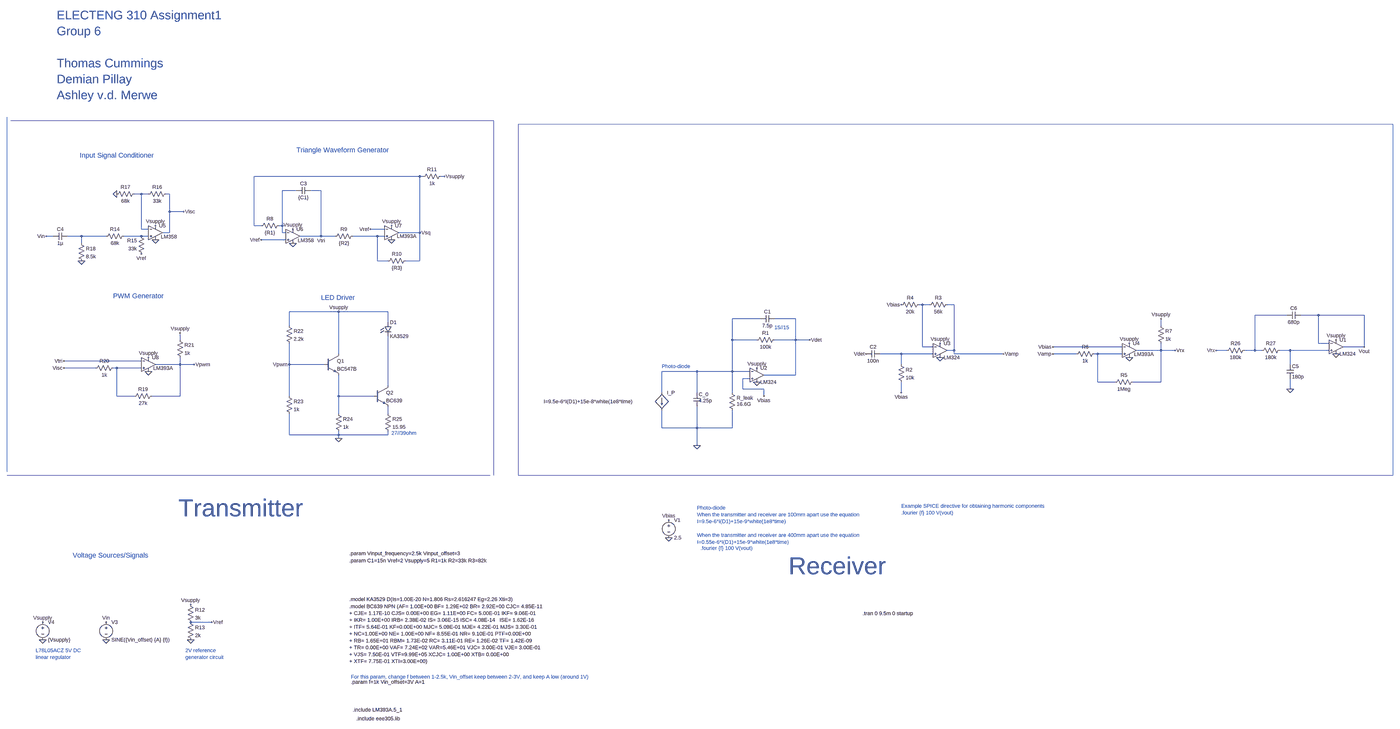
[diagram p0: schematic Assignment2_LM324_demian.asc, whole sheet]
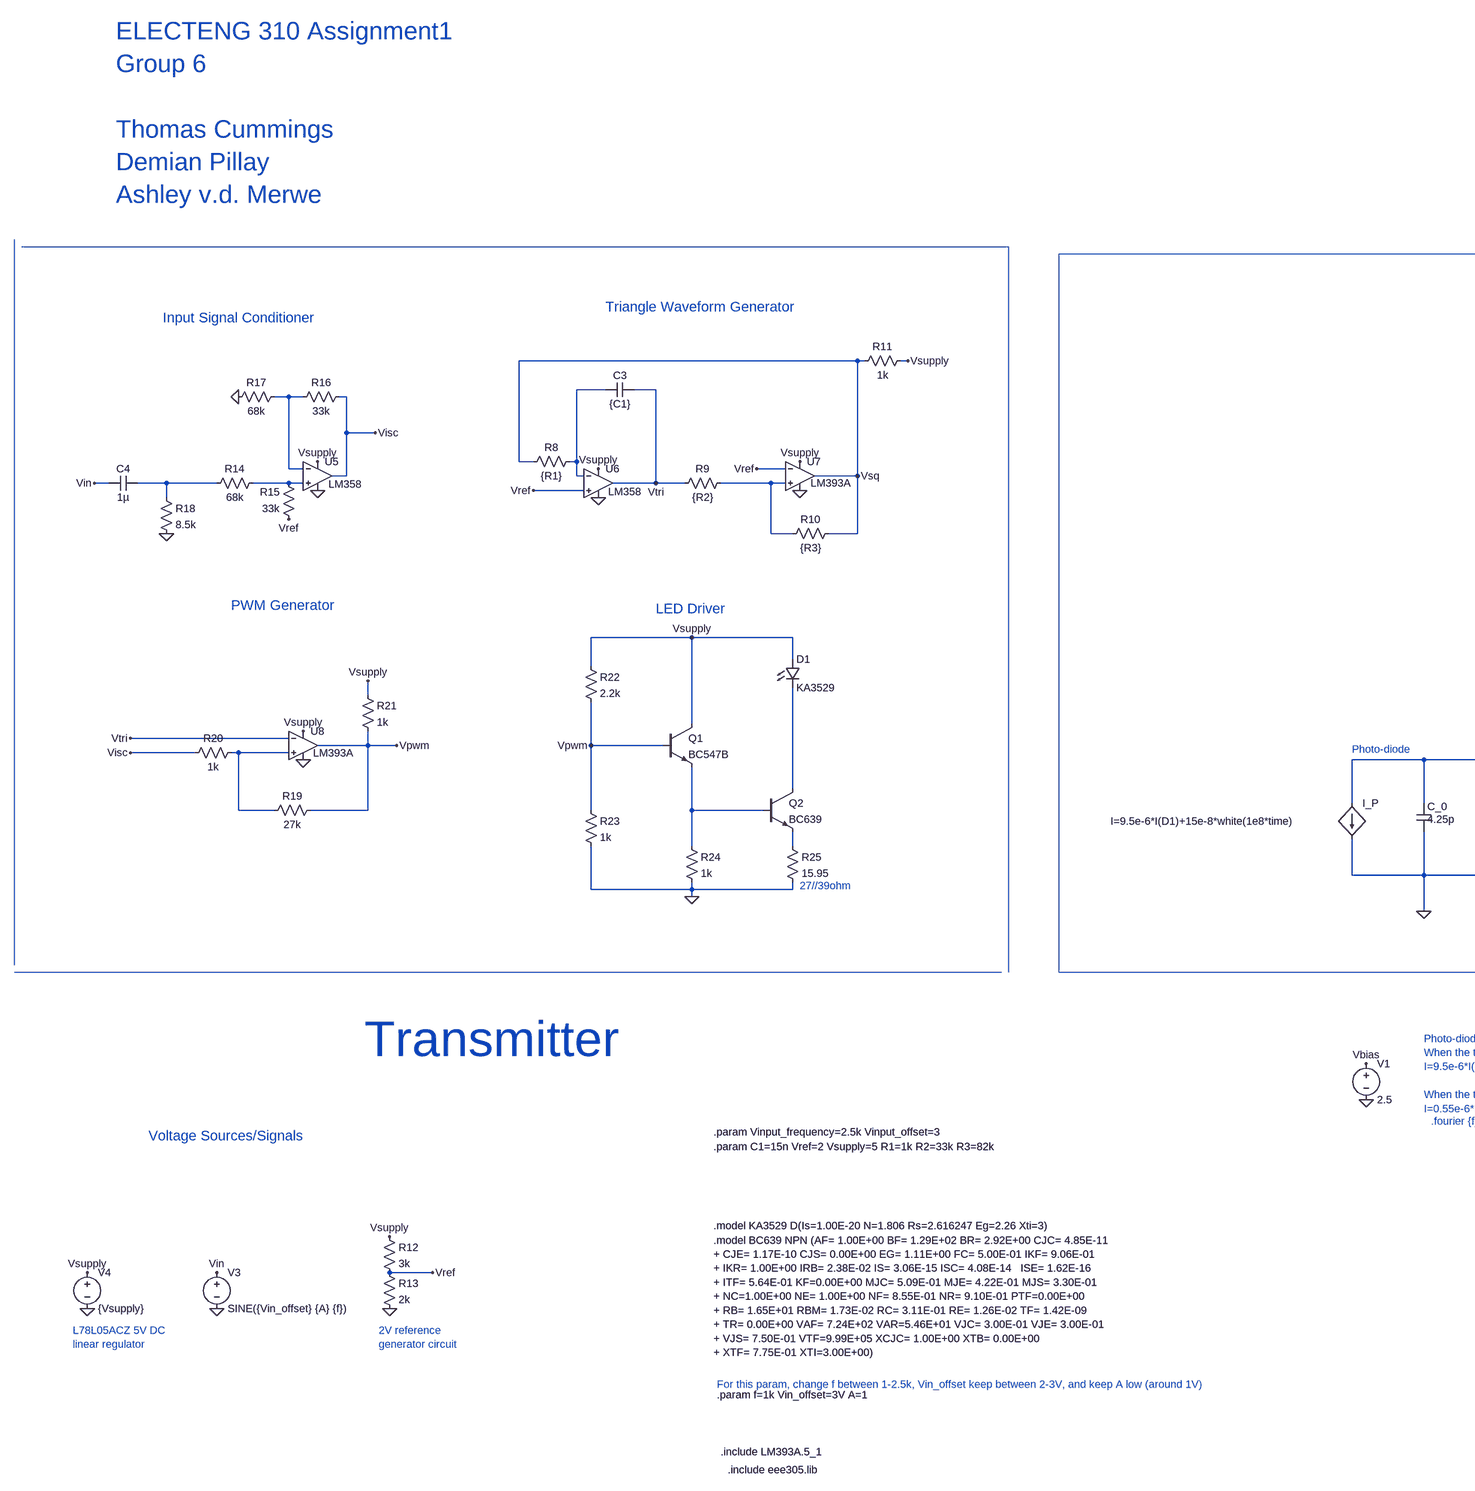
[diagram p1: schematic Assignment2_LM324_demian.asc, part, row 1 of 1, column 1 of 2]
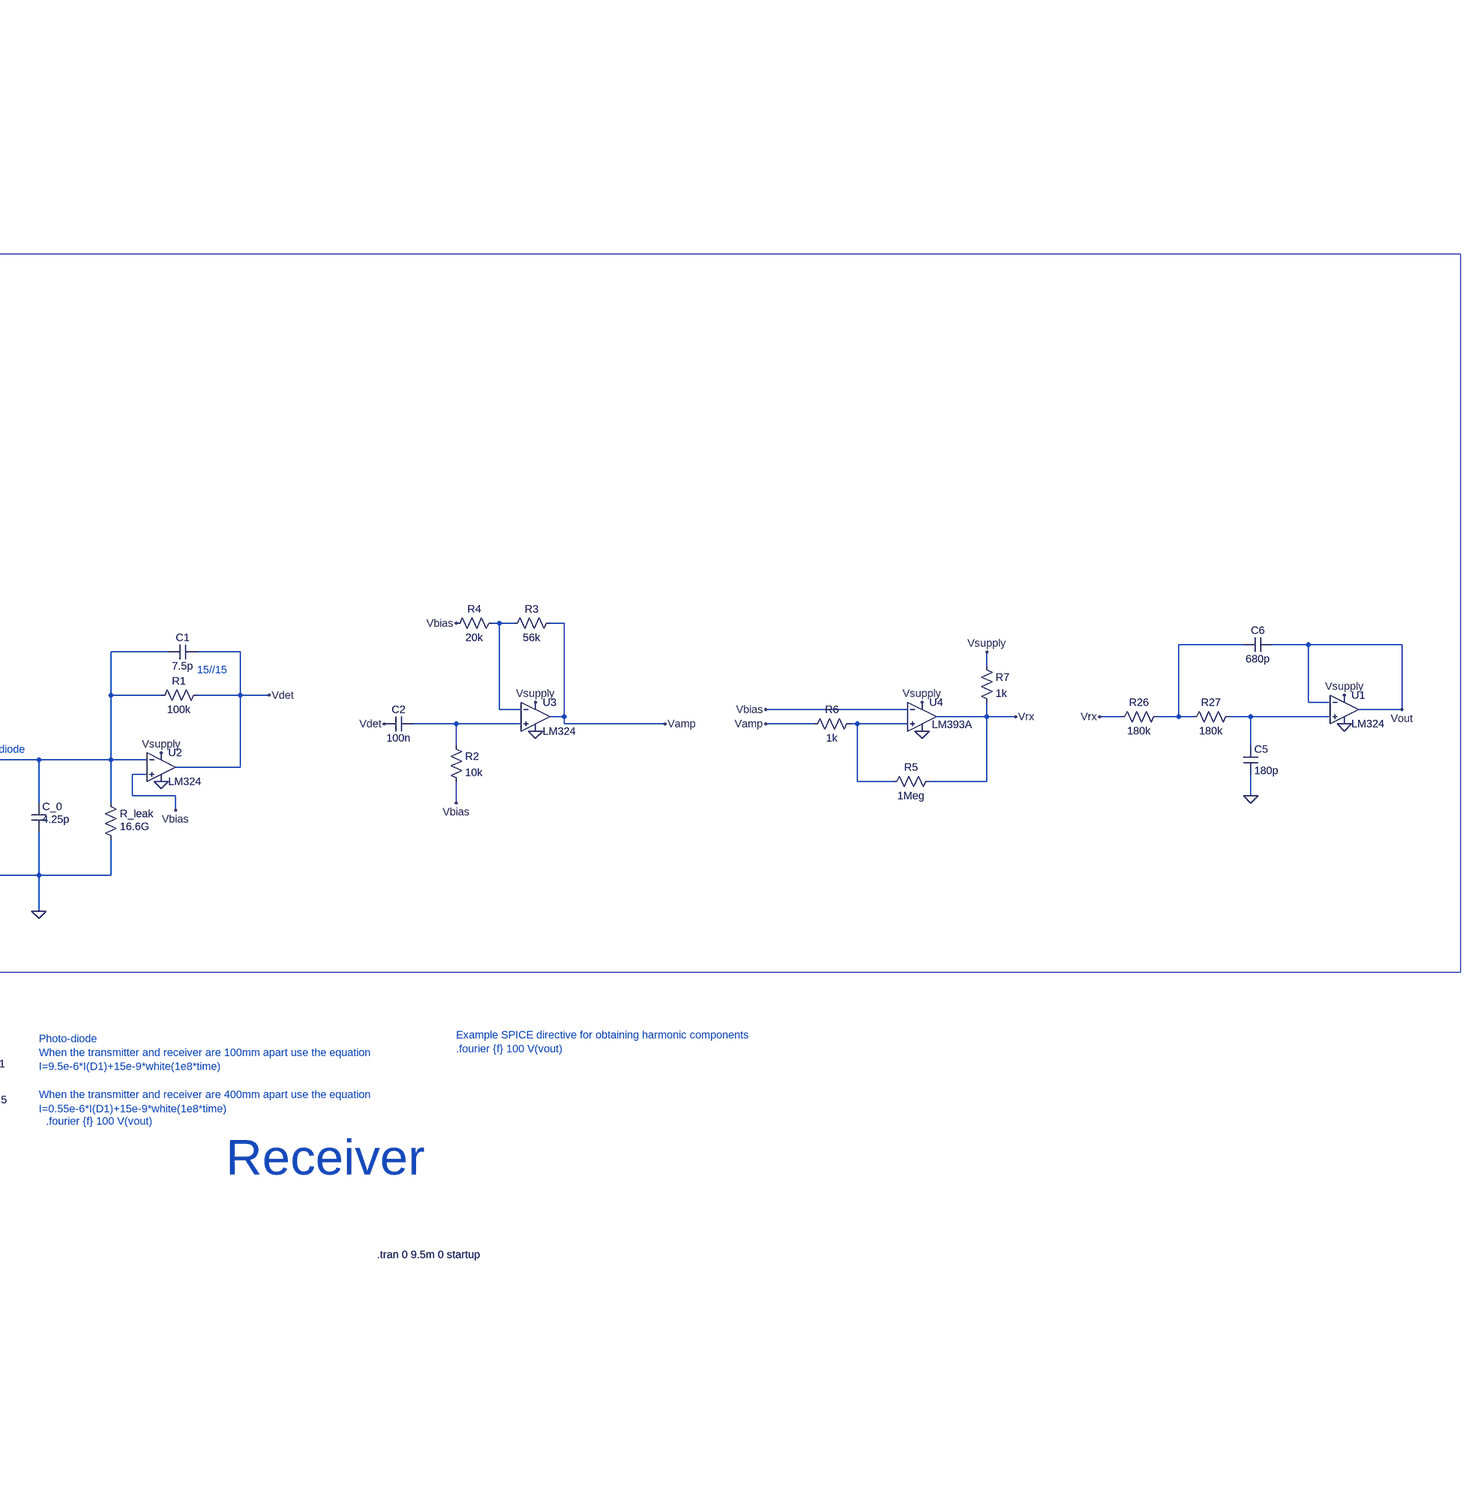
[diagram p2: schematic Assignment2_LM324_demian.asc, part, row 1 of 1, column 2 of 2]
Assignment2_LM324_demian.asc, the LTspice schematic file:
Version 4
SHEET 1 6180 2120
WIRE 1456 -928 704 -928
WIRE 1472 -928 1456 -928
WIRE 1568 -928 1552 -928
WIRE 896 -864 832 -864
WIRE 1008 -864 960 -864
WIRE 192 -848 160 -848
WIRE 224 -848 192 -848
WIRE 320 -848 304 -848
WIRE 320 -768 320 -848
WIRE 384 -768 320 -768
WIRE 704 -704 704 -928
WIRE 736 -704 704 -704
WIRE 832 -704 832 -864
WIRE 832 -704 816 -704
WIRE 192 -688 192 -848
WIRE 224 -688 192 -688
WIRE 1296 -688 1232 -688
WIRE 320 -672 320 -768
WIRE 320 -672 288 -672
WIRE 832 -672 832 -704
WIRE 848 -672 832 -672
WIRE 1456 -672 1456 -928
WIRE 1456 -672 1360 -672
WIRE -208 -656 -240 -656
WIRE -80 -656 -144 -656
WIRE 32 -656 -80 -656
WIRE 192 -656 112 -656
WIRE 224 -656 192 -656
WIRE 1008 -656 1008 -864
WIRE 1008 -656 912 -656
WIRE 1072 -656 1008 -656
WIRE 1264 -656 1152 -656
WIRE 1296 -656 1264 -656
WIRE 848 -640 736 -640
WIRE -80 -624 -80 -656
WIRE 1264 -544 1264 -656
WIRE 1312 -544 1264 -544
WIRE 1456 -544 1456 -672
WIRE 1456 -544 1392 -544
WIRE 3744 -320 3728 -320
WIRE 3776 -320 3744 -320
WIRE 3888 -320 3856 -320
WIRE 1088 -288 864 -288
WIRE 1312 -288 1088 -288
WIRE 5488 -272 5344 -272
WIRE 5632 -272 5552 -272
WIRE 5840 -272 5632 -272
WIRE 3008 -256 2880 -256
WIRE 3168 -256 3072 -256
WIRE 1312 -240 1312 -288
WIRE 864 -224 864 -288
WIRE 4864 -224 4864 -256
WIRE 368 -160 368 -192
WIRE 2880 -160 2880 -256
WIRE 2992 -160 2880 -160
WIRE 3168 -160 3168 -256
WIRE 3168 -160 3072 -160
WIRE 3232 -160 3168 -160
WIRE 5632 -144 5632 -272
WIRE 5680 -144 5632 -144
WIRE 3744 -128 3744 -320
WIRE 3792 -128 3744 -128
WIRE 4688 -128 4336 -128
WIRE 5840 -128 5840 -272
WIRE 5840 -128 5744 -128
WIRE 3888 -112 3888 -320
WIRE 3888 -112 3856 -112
WIRE 4864 -112 4864 -144
WIRE 4864 -112 4752 -112
WIRE 4928 -112 4864 -112
WIRE 5216 -112 5168 -112
WIRE 5344 -112 5344 -272
WIRE 5344 -112 5296 -112
WIRE 5376 -112 5344 -112
WIRE 5504 -112 5456 -112
WIRE 5680 -112 5504 -112
WIRE 1088 -96 1088 -288
WIRE 3648 -96 3552 -96
WIRE 3792 -96 3648 -96
WIRE 3888 -96 3888 -112
WIRE 4112 -96 3888 -96
WIRE 4480 -96 4336 -96
WIRE 4576 -96 4560 -96
WIRE 4688 -96 4576 -96
WIRE 192 -64 -160 -64
WIRE 368 -48 368 -80
WIRE 368 -48 256 -48
WIRE 432 -48 368 -48
WIRE 864 -48 864 -144
WIRE 1024 -48 864 -48
WIRE 3648 -48 3648 -96
WIRE 5504 -48 5504 -112
WIRE -16 -32 -160 -32
WIRE 80 -32 64 -32
WIRE 192 -32 80 -32
WIRE 2720 -16 2560 -16
WIRE 2880 -16 2880 -160
WIRE 2880 -16 2720 -16
WIRE 2960 -16 2880 -16
WIRE 3168 0 3168 -160
WIRE 3168 0 3024 0
WIRE 2960 16 2928 16
WIRE 4576 32 4576 -96
WIRE 4656 32 4576 32
WIRE 4864 32 4864 -112
WIRE 4864 32 4736 32
WIRE 1312 48 1312 -176
WIRE 2928 64 2928 16
WIRE 3024 64 2928 64
WIRE 5504 64 5504 16
WIRE 2560 80 2560 -16
WIRE 2720 80 2720 -16
WIRE 2880 80 2880 -16
WIRE 3648 80 3648 32
WIRE 80 96 80 -32
WIRE 160 96 80 96
WIRE 368 96 368 -48
WIRE 368 96 240 96
WIRE 864 96 864 -48
WIRE 1088 96 1088 0
WIRE 1248 96 1088 96
WIRE 3024 96 3024 64
WIRE 1088 176 1088 96
WIRE 1312 176 1312 144
WIRE 2560 240 2560 160
WIRE 2720 240 2720 144
WIRE 2720 240 2560 240
WIRE 2880 240 2880 160
WIRE 2880 240 2720 240
WIRE 864 272 864 176
WIRE 1088 272 1088 256
WIRE 1088 272 864 272
WIRE 1312 272 1312 256
WIRE 1312 272 1088 272
WIRE 1088 288 1088 272
WIRE 2720 320 2720 240
WIRE 512 1312 416 1312
FLAG 32 1392 0
FLAG 32 1312 Vin
FLAG 2720 320 0
FLAG 2592 896 0
FLAG 2992 32 0
FLAG 2992 -32 Vsupply
FLAG 3824 -80 0
FLAG 3824 -144 Vsupply
FLAG 2592 816 Vbias
FLAG 3024 96 Vbias
FLAG 3648 80 Vbias
FLAG 3648 -320 Vbias
FLAG 3232 -160 Vdet
FLAG 3488 -96 Vdet
FLAG 4720 -144 Vsupply
FLAG 4720 -80 0
FLAG 4336 -128 Vbias
FLAG 4864 -256 Vsupply
FLAG 4928 -112 Vrx
FLAG -256 1392 0
FLAG -256 1312 Vsupply
FLAG 1008 -656 Vtri
FLAG 1328 -640 0
FLAG 880 -624 0
FLAG 736 -640 Vref
FLAG 1232 -688 Vref
FLAG 1456 -672 Vsq
FLAG 880 -688 Vsupply
FLAG 1328 -704 Vsupply
FLAG 1568 -928 Vsupply
FLAG 416 1392 0
FLAG 416 1232 Vsupply
FLAG 80 -848 0
FLAG 192 -576 Vref
FLAG 256 -640 0
FLAG 256 -704 Vsupply
FLAG -80 -544 0
FLAG 224 -80 Vsupply
FLAG 224 -16 0
FLAG 384 -768 Visc
FLAG -160 -64 Vtri
FLAG 368 -192 Vsupply
FLAG 432 -48 Vpwm
FLAG 1088 -288 Vsupply
FLAG 864 -48 Vpwm
FLAG 1088 288 0
FLAG -240 -656 Vin
FLAG -160 -32 Visc
FLAG 512 1312 Vref
FLAG 4112 -96 Vamp
FLAG 4336 -96 Vamp
FLAG 5504 64 0
FLAG 5712 -160 Vsupply
FLAG 5168 -112 Vrx
FLAG 5712 -96 0
FLAG 5840 -128 Vout
SYMBOL voltage 32 1296 R0
WINDOW 123 0 0 Left 0
WINDOW 39 0 0 Left 0
SYMATTR InstName V3
SYMATTR Value SINE({Vin_offset} {A} {f})
SYMBOL LED 1296 -240 R0
SYMATTR InstName D1
SYMATTR Value KA3529
SYMBOL bi 2560 80 R0
WINDOW 3 -541 40 Left 2
SYMATTR Value I=9.5e-6*I(D1)+15e-8*white(1e8*time)
SYMATTR InstName I_P
SYMBOL cap 2704 80 R0
WINDOW 3 24 36 Left 2
SYMATTR Value 4.25p
SYMATTR InstName C_0
SYMBOL res 2864 64 R0
WINDOW 3 36 68 Left 2
SYMATTR Value 16.6G
SYMATTR InstName R_leak
SYMBOL cap 3072 -272 R90
WINDOW 0 0 32 VBottom 2
WINDOW 3 32 32 VTop 2
SYMATTR InstName C1
SYMATTR Value 7.5p
SYMBOL res 3088 -176 R90
WINDOW 0 0 56 VBottom 2
WINDOW 3 32 56 VTop 2
SYMATTR InstName R1
SYMATTR Value 100k
SYMBOL voltage 2592 800 R0
WINDOW 123 0 0 Left 0
WINDOW 39 0 0 Left 0
SYMATTR InstName V1
SYMATTR Value 2.5
SYMBOL cap 3552 -112 R90
WINDOW 0 0 32 VBottom 2
WINDOW 3 32 32 VTop 2
SYMATTR InstName C2
SYMATTR Value 100n
SYMBOL res 3632 -64 R0
SYMATTR InstName R2
SYMATTR Value 10k
SYMBOL res 3872 -336 R90
WINDOW 0 0 56 VBottom 2
WINDOW 3 32 56 VTop 2
SYMATTR InstName R3
SYMATTR Value 56k
SYMBOL res 3744 -336 R90
WINDOW 0 0 56 VBottom 2
WINDOW 3 32 56 VTop 2
SYMATTR InstName R4
SYMATTR Value 20k
SYMBOL OpAmps\\opamp2 2992 -64 R0
SYMATTR InstName U2
SYMATTR Value LM324
SYMBOL OpAmps\\opamp2 3824 -176 R0
SYMATTR InstName U3
SYMATTR Value LM324
SYMBOL res 4752 16 R90
WINDOW 0 0 56 VBottom 2
WINDOW 3 32 56 VTop 2
SYMATTR InstName R5
SYMATTR Value 1Meg
SYMBOL res 4576 -112 R90
WINDOW 0 0 56 VBottom 2
WINDOW 3 32 56 VTop 2
SYMATTR InstName R6
SYMATTR Value 1k
SYMBOL res 4848 -240 R0
SYMATTR InstName R7
SYMATTR Value 1k
SYMBOL OpAmps\\opamp2 4720 -176 R0
WINDOW 3 22 81 Left 2
SYMATTR Value LM393A
SYMATTR InstName U4
SYMBOL voltage -256 1296 R0
WINDOW 123 0 0 Left 0
WINDOW 39 0 0 Left 0
SYMATTR InstName V4
SYMATTR Value {Vsupply}
SYMBOL res 832 -720 R90
WINDOW 0 0 56 VBottom 2
WINDOW 3 32 56 VTop 2
SYMATTR InstName R8
SYMATTR Value {R1}
SYMBOL cap 960 -880 R90
WINDOW 0 0 32 VBottom 2
WINDOW 3 32 32 VTop 2
SYMATTR InstName C3
SYMATTR Value {C1}
SYMATTR SpiceLine Rser=10m
SYMBOL res 1168 -672 R90
WINDOW 0 0 56 VBottom 2
WINDOW 3 32 56 VTop 2
SYMATTR InstName R9
SYMATTR Value {R2}
SYMBOL res 1408 -560 R90
WINDOW 0 0 56 VBottom 2
WINDOW 3 32 56 VTop 2
SYMATTR InstName R10
SYMATTR Value {R3}
SYMBOL res 1568 -944 R90
WINDOW 0 0 56 VBottom 2
WINDOW 3 32 56 VTop 2
SYMATTR InstName R11
SYMATTR Value 1k
SYMBOL res 400 1216 R0
SYMATTR InstName R12
SYMATTR Value 3k
SYMBOL res 400 1296 R0
SYMATTR InstName R13
SYMATTR Value 2k
SYMBOL res 128 -672 R90
WINDOW 0 0 56 VBottom 2
WINDOW 3 32 56 VTop 2
SYMATTR InstName R14
SYMATTR Value 68k
SYMBOL res 208 -560 R180
WINDOW 0 36 76 Left 2
WINDOW 3 36 40 Left 2
SYMATTR InstName R15
SYMATTR Value 33k
SYMBOL res 208 -832 R270
WINDOW 0 32 56 VTop 2
WINDOW 3 0 56 VBottom 2
SYMATTR InstName R16
SYMATTR Value 33k
SYMBOL res 64 -832 R270
WINDOW 0 32 56 VTop 2
WINDOW 3 0 56 VBottom 2
SYMATTR InstName R17
SYMATTR Value 68k
SYMBOL cap -144 -672 R90
WINDOW 0 0 32 VBottom 2
WINDOW 3 32 32 VTop 2
SYMATTR InstName C4
SYMATTR Value 1µ
SYMBOL res -96 -640 R0
SYMATTR InstName R18
SYMATTR Value 8.5k
SYMBOL res 256 80 R90
WINDOW 0 0 56 VBottom 2
WINDOW 3 32 56 VTop 2
SYMATTR InstName R19
SYMATTR Value 27k
SYMBOL res 80 -48 R90
WINDOW 0 0 56 VBottom 2
WINDOW 3 32 56 VTop 2
SYMATTR InstName R20
SYMATTR Value 1k
SYMBOL res 352 -176 R0
SYMATTR InstName R21
SYMATTR Value 1k
SYMBOL OpAmps\\opamp2 256 -736 R0
WINDOW 3 24 82 Left 2
SYMATTR Value LM358
SYMATTR InstName U5
SYMBOL OpAmps\\opamp2 880 -720 R0
WINDOW 3 22 83 Left 2
SYMATTR Value LM358
SYMATTR InstName U6
SYMBOL OpAmps\\opamp2 1328 -736 R0
WINDOW 3 24 80 Left 2
SYMATTR Value LM393A
SYMATTR InstName U7
SYMBOL OpAmps\\opamp2 224 -112 R0
WINDOW 3 22 81 Left 2
SYMATTR Value LM393A
SYMATTR InstName U8
SYMBOL npn 1024 -96 R0
SYMATTR InstName Q1
SYMATTR Value BC547B
SYMBOL res 848 -240 R0
SYMATTR InstName R22
SYMATTR Value 2.2k
SYMBOL res 848 80 R0
SYMATTR InstName R23
SYMATTR Value 1k
SYMBOL res 1072 160 R0
SYMATTR InstName R24
SYMATTR Value 1k
SYMBOL res 1296 160 R0
SYMATTR InstName R25
SYMATTR Value 15.95
SYMBOL npn 1248 48 R0
SYMATTR InstName Q2
SYMATTR Value BC639
SYMBOL res 5312 -128 R90
WINDOW 0 0 56 VBottom 2
WINDOW 3 32 56 VTop 2
SYMATTR InstName R26
SYMATTR Value 180k
SYMBOL res 5472 -128 R90
WINDOW 0 0 56 VBottom 2
WINDOW 3 32 56 VTop 2
SYMATTR InstName R27
SYMATTR Value 180k
SYMBOL cap 5488 -48 R0
SYMATTR InstName C5
SYMATTR Value 180p
SYMBOL cap 5552 -288 R90
WINDOW 0 0 32 VBottom 2
WINDOW 3 32 32 VTop 2
SYMATTR InstName C6
SYMATTR Value 680p
SYMBOL OpAmps\\opamp2 5712 -192 R0
SYMATTR InstName U1
SYMATTR Value LM324
TEXT 3472 1272 Left 2 !.tran 0 9.5m 0 startup
TEXT 1144 1584 Left 2 !.param f=1k Vin_offset=3V A=1
TEXT 2560 -40 Left 2 ;Photo-diode
TEXT 1144 1560 Left 2 ;For this param, change f between 1-2.5k, Vin_offset keep between 2-3V, and keep A low (around 1V)
TEXT 3648 752 Left 2 ;Example SPICE directive for obtaining harmonic components\n.fourier {f} 100 V(vout)
TEXT 2720 760 Left 2 ;Photo-diode\nWhen the transmitter and receiver are 100mm apart use the equation\nI=9.5e-6*I(D1)+15e-9*white(1e8*time)\n \nWhen the transmitter and receiver are 400mm apart use the equation\nI=0.55e-6*I(D1)+15e-9*white(1e8*time)
TEXT 360 760 Left 7 ;Transmitter
TEXT 3136 1024 Left 7 ;Receiver
TEXT 1152 1720 Left 2 !.include LM393A.5_1
TEXT 1168 1760 Left 2 !.include eee305.lib
TEXT 2736 944 Left 2 ;.fourier {f} 100 V(vout)
TEXT 3072 -216 Left 2 ;15//15
TEXT 1136 1000 Left 2 !.param C1=15n Vref=2 Vsupply=5 R1=1k R2=33k R3=82k
TEXT 1136 968 Left 2 !.param Vinput_frequency=2.5k Vinput_offset=3
TEXT 1136 1208 Left 2 !.model KA3529 D(Is=1.00E-20 N=1.806 Rs=2.616247 Eg=2.26 Xti=3)
TEXT 1328 264 Left 2 ;27//39ohm
TEXT 896 -1048 Left 3 ;Triangle Waveform Generator
TEXT -88 -1024 Left 3 ;Input Signal Conditioner
TEXT 1008 -352 Left 3 ;LED Driver
TEXT 64 -360 Left 3 ;PWM Generator
TEXT 1136 1240 Left 2 !.model BC639 NPN (AF= 1.00E+00 BF= 1.29E+02 BR= 2.92E+00 CJC= 4.85E-11 \n+ CJE= 1.17E-10 CJS= 0.00E+00 EG= 1.11E+00 FC= 5.00E-01 IKF= 9.06E-01 \n+ IKR= 1.00E+00 IRB= 2.38E-02 IS= 3.06E-15 ISC= 4.08E-14   ISE= 1.62E-16 \n+ ITF= 5.64E-01 KF=0.00E+00 MJC= 5.09E-01 MJE= 4.22E-01 MJS= 3.30E-01 \n+ NC=1.00E+00 NE= 1.00E+00 NF= 8.55E-01 NR= 9.10E-01 PTF=0.00E+00 \n+ RB= 1.65E+01 RBM= 1.73E-02 RC= 3.11E-01 RE= 1.26E-02 TF= 1.42E-09  \n+ TR= 0.00E+00 VAF= 7.24E+02 VAR=5.46E+01 VJC= 3.00E-01 VJE= 3.00E-01 \n+ VJS= 7.50E-01 VTF=9.99E+05 XCJC= 1.00E+00 XTB= 0.00E+00 \n+ XTF= 7.75E-01 XTI=3.00E+00)
TEXT -288 1440 Left 2 ;L78L05ACZ 5V DC\nlinear regulator
TEXT 392 1440 Left 2 ;2V reference \ngenerator circuit
TEXT -120 976 Left 3 ;Voltage Sources/Signals
TEXT -192 -1680 Left 5 ;ELECTENG 310 Assignment1\nGroup 6\n \nThomas Cummings\nDemian Pillay\nAshley v.d. Merwe
LINE Normal 1792 -1200 1792 576
LINE Normal -432 -1200 1792 -1200
LINE Normal -448 576 1776 576
LINE Normal -448 -1216 -448 560
RECTANGLE Normal 6144 576 1904 -1184

The netlist it stands for:
* Assignment2_LM324_demian.asc
V3 Vin 0 SINE({Vin_offset} {A} {f})
D1 Vsupply N013 KA3529
B§I_P N008 0 I=9.5e-6*I(D1)+15e-8*white(1e8*time)
C_0 N008 0 4.25p
R_leak N008 0 16.6G
C1 Vdet N008 7.5p
R1 Vdet N008 100k
V1 Vbias 0 2.5
C2 N010 Vdet 100n
R2 N010 Vbias 10k
R3 Vamp N006 56k
R4 N006 Vbias 20k
XU2 Vbias N008 Vsupply 0 Vdet LM324  ; pins In+ In- V+ V- OUT
XU3 N010 N006 Vsupply 0 Vamp LM324  ; pins In+ In- V+ V- OUT
R5 Vrx N011 1Meg
R6 N011 Vamp 1k
R7 Vsupply Vrx 1k
XU4 N011 Vbias Vsupply 0 Vrx LM393A  ; pins In+ In- V+ V- OUT
V4 Vsupply 0 {Vsupply}
R8 N001 Vsq {R1}
C3 Vtri N001 {C1} Rser=10m
R9 N005 Vtri {R2}
R10 Vsq N005 {R3}
R11 Vsupply Vsq 1k
R12 Vsupply Vref 3k
R13 Vref 0 2k
R14 N004 N003 68k
R15 Vref N004 33k
R16 N002 Visc 33k
R17 0 N002 68k
C4 N003 Vin 1µ
R18 N003 0 8.5k
R19 Vpwm N012 27k
R20 N012 Visc 1k
R21 Vsupply Vpwm 1k
XU5 N004 N002 Vsupply 0 Visc LM358  ; pins In+ In- V+ V- OUT
XU6 Vref N001 Vsupply 0 Vtri LM358  ; pins In+ In- V+ V- OUT
XU7 N005 Vref Vsupply 0 Vsq LM393A  ; pins In+ In- V+ V- OUT
XU8 N012 Vtri Vsupply 0 Vpwm LM393A  ; pins In+ In- V+ V- OUT
Q1 Vsupply Vpwm N014 0 BC547B
R22 Vsupply Vpwm 2.2k
R23 Vpwm 0 1k
R24 N014 0 1k
R25 N015 0 15.95
Q2 N013 N014 N015 0 BC639
R26 N007 Vrx 180k
R27 N009 N007 180k
C5 N009 0 180p
C6 Vout N007 680p
XU1 N009 Vout Vsupply 0 Vout LM324  ; pins In+ In- V+ V- OUT
.model D D
.lib standard.dio
.model NPN NPN
.model PNP PNP
.lib standard.bjt
.tran 0 9.5m 0 startup
.param f=1k Vin_offset=3V A=1
* Photo-diode
* For this param, change f between 1-2.5k, Vin_offset keep between 2-3V, and keep A low (around 1V)
* Example SPICE directive for obtaining harmonic components
* .fourier {f} 100 V(vout)
* Photo-diode
* When the transmitter and receiver are 100mm apart use the equation
* I=9.5e-6*I(D1)+15e-9*white(1e8*time)
* When the transmitter and receiver are 400mm apart use the equation
* I=0.55e-6*I(D1)+15e-9*white(1e8*time)
* Transmitter
* Receiver
.include LM393A.5_1
.include eee305.lib
* .fourier {f} 100 V(vout)
* 15//15
.param C1=15n Vref=2 Vsupply=5 R1=1k R2=33k R3=82k
.param Vinput_frequency=2.5k Vinput_offset=3
.model KA3529 D(Is=1.00E-20 N=1.806 Rs=2.616247 Eg=2.26 Xti=3)
* 27//39ohm
* Triangle Waveform Generator
* Input Signal Conditioner
* LED Driver
* PWM Generator
.model BC639 NPN (AF= 1.00E+00 BF= 1.29E+02 BR= 2.92E+00 CJC= 4.85E-11
+ CJE= 1.17E-10 CJS= 0.00E+00 EG= 1.11E+00 FC= 5.00E-01 IKF= 9.06E-01
+ IKR= 1.00E+00 IRB= 2.38E-02 IS= 3.06E-15 ISC= 4.08E-14   ISE= 1.62E-16
+ ITF= 5.64E-01 KF=0.00E+00 MJC= 5.09E-01 MJE= 4.22E-01 MJS= 3.30E-01
+ NC=1.00E+00 NE= 1.00E+00 NF= 8.55E-01 NR= 9.10E-01 PTF=0.00E+00
+ RB= 1.65E+01 RBM= 1.73E-02 RC= 3.11E-01 RE= 1.26E-02 TF= 1.42E-09
+ TR= 0.00E+00 VAF= 7.24E+02 VAR=5.46E+01 VJC= 3.00E-01 VJE= 3.00E-01
+ VJS= 7.50E-01 VTF=9.99E+05 XCJC= 1.00E+00 XTB= 0.00E+00
+ XTF= 7.75E-01 XTI=3.00E+00)
* L78L05ACZ 5V DC
* linear regulator
* 2V reference
* generator circuit
* Voltage Sources/Signals
* ELECTENG 310 Assignment1
* Group 6
* Thomas Cummings
* Demian Pillay
* Ashley v.d. Merwe
.backanno
.end